# Altium schematic sheet [02] - BLOCK DIAGRAM.SchDoc
size A2; DocumentNumber: 3; SheetNumber: 3; SheetTotal: 9; PageSetup: Record=PageOptions|CenterHorizontal=True|CenterVertical=True|PrintScale=0.73|XCorrection=1.00|YCorrection=1.00|PrintKind=0|BorderSize=5000000|LeftOffset=0|BottomOffset=0|Orientation=2|PaperLength=1000|PaperWidth=1000|Scale=100|PaperSource=7|PrintQuality=-4|MediaType=1|DitherType=10|PaperKind=A3|PrintScaleMode=1
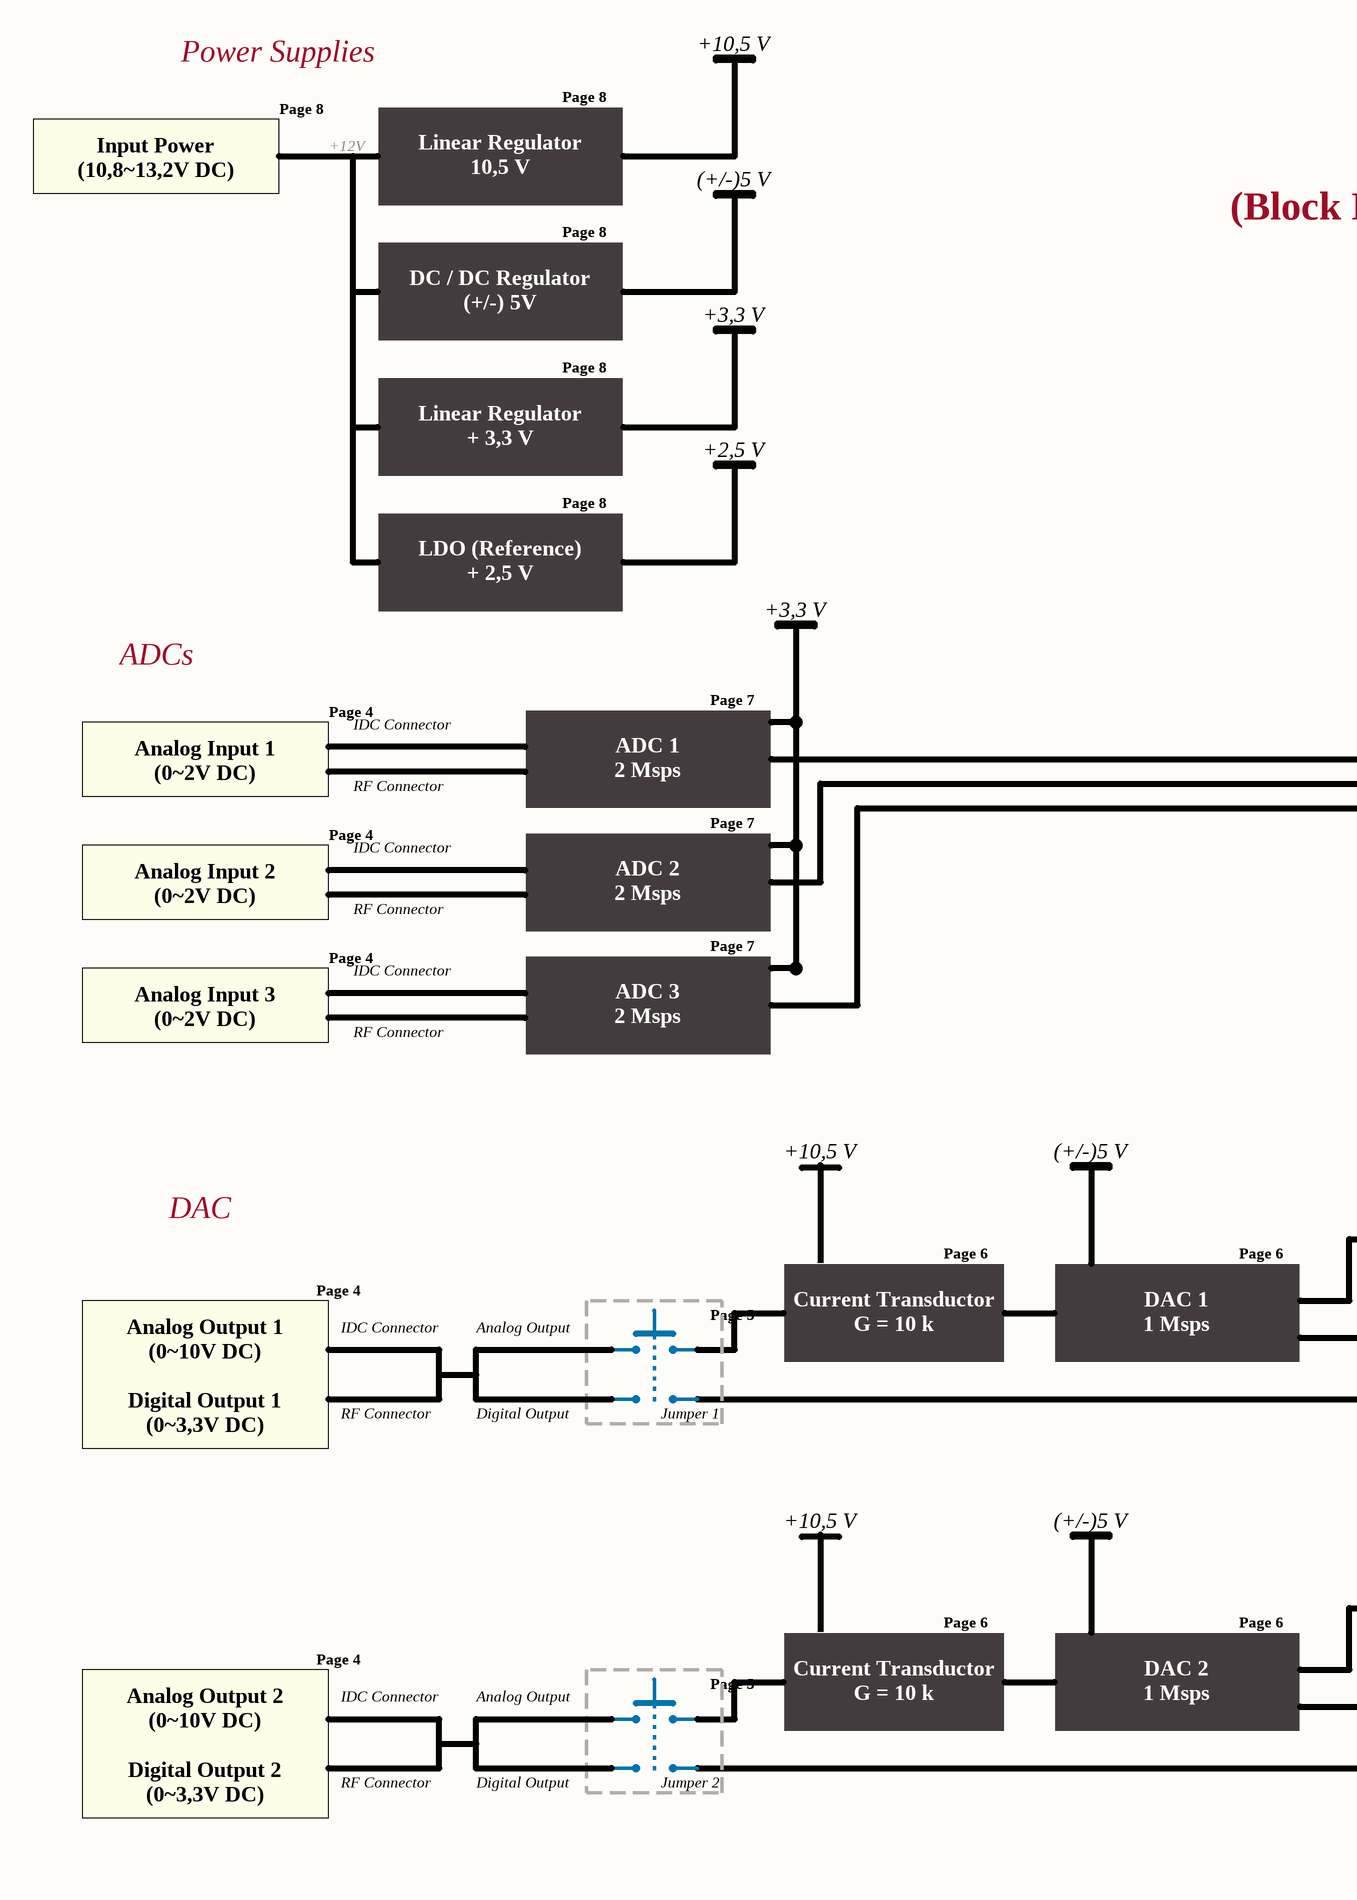
[diagram p0: [02] - BLOCK DIAGRAM.SchDoc, left]
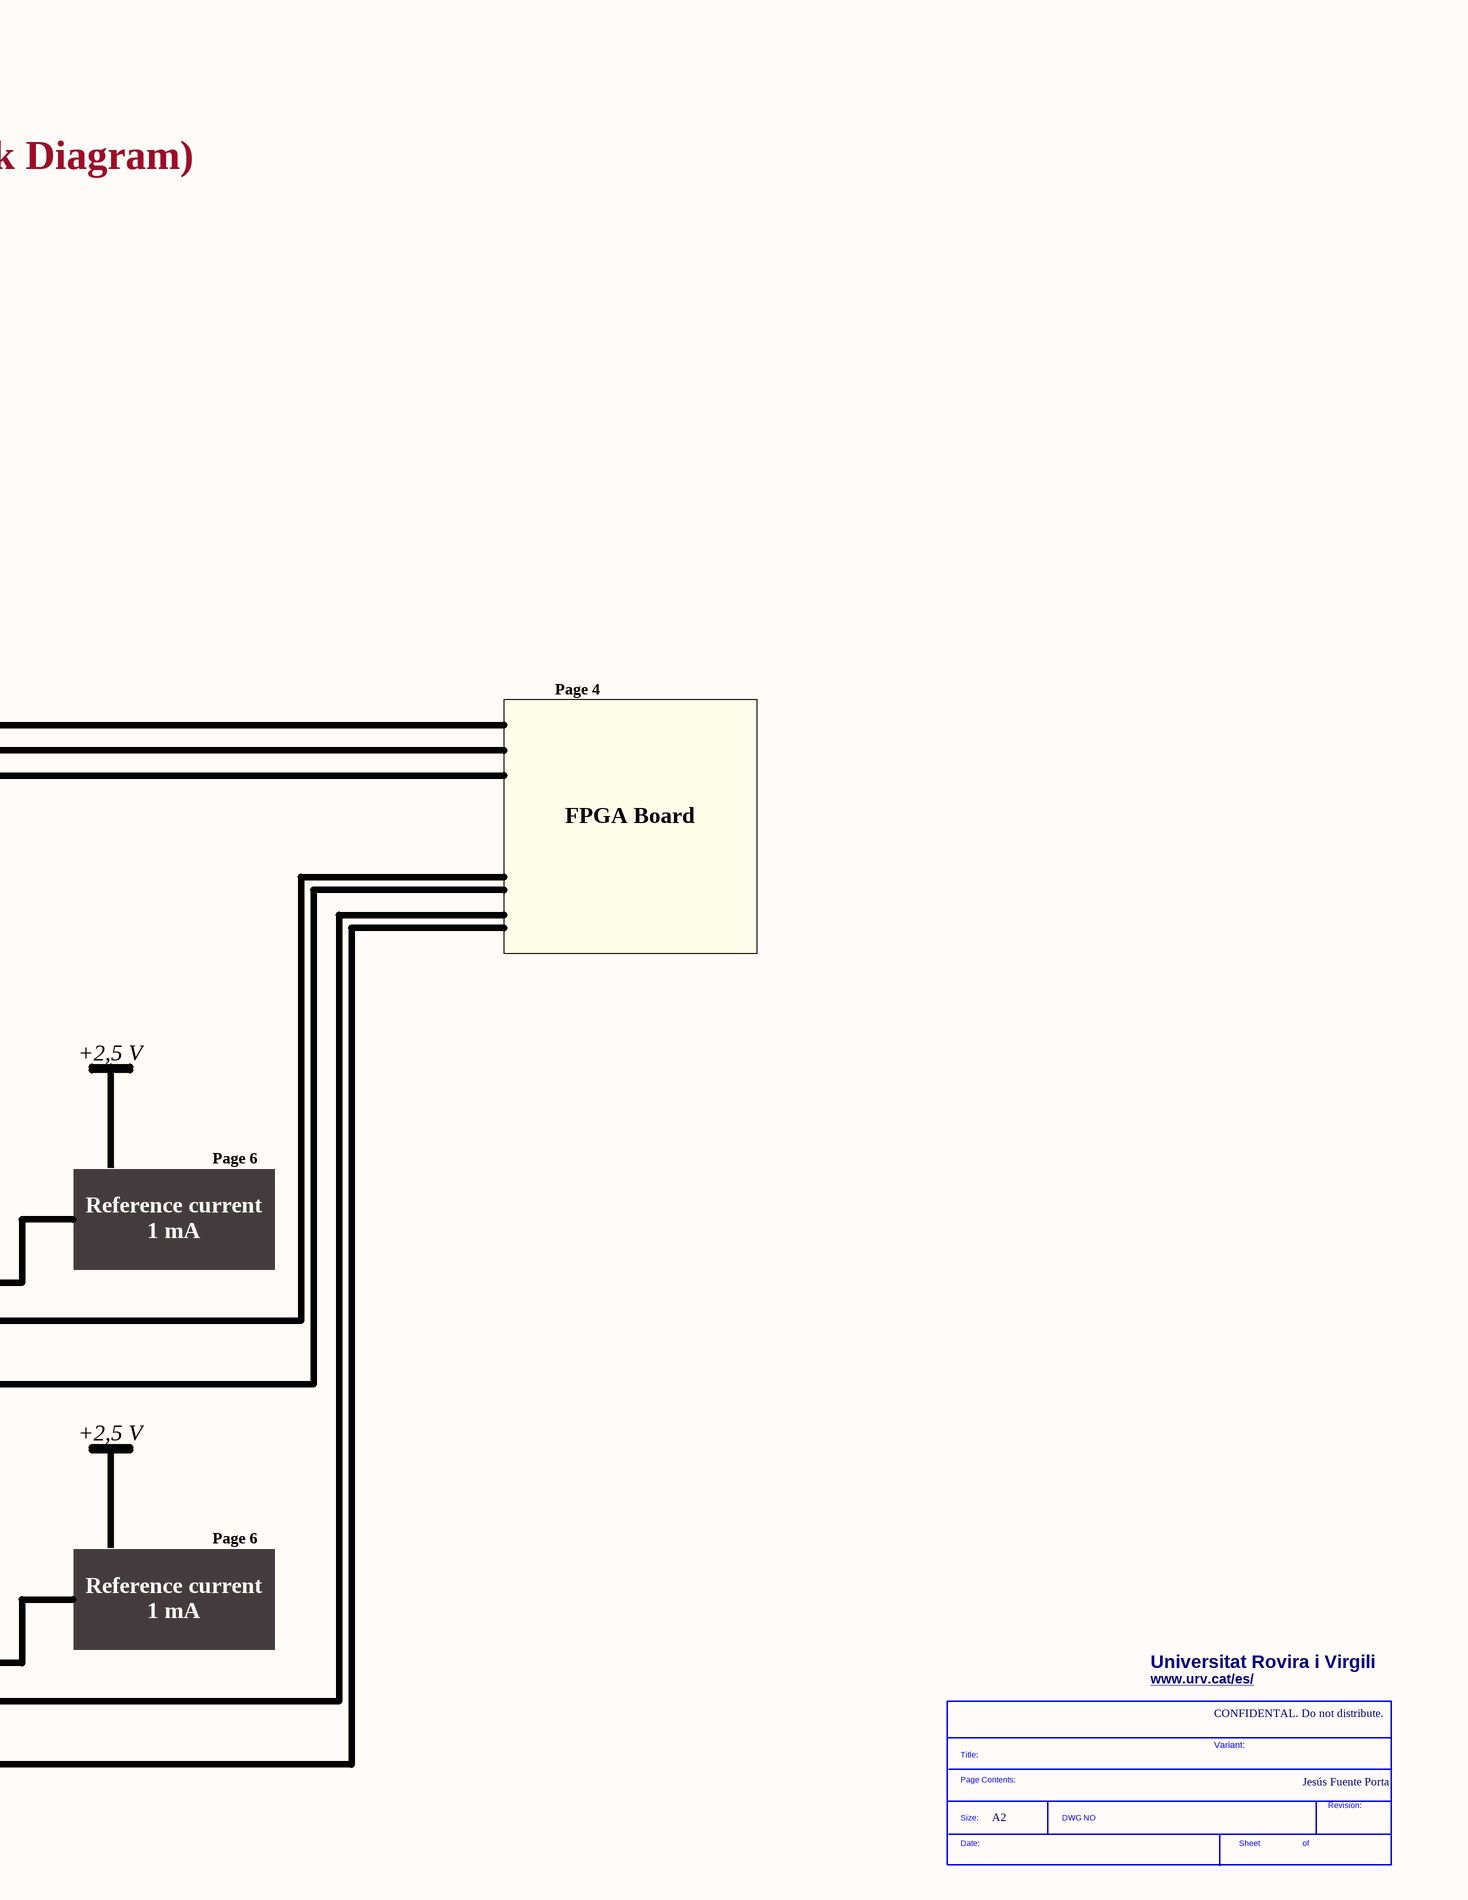
[diagram p1: [02] - BLOCK DIAGRAM.SchDoc, right]

## Parts
*  SDTitleBlock  (value not drawn)  (graphical)

## Notes on the sheet
- Power Supplies
- +10,5 V
- Input Power
- Page 8
- (10,8~13,2V DC)
- +12V
- Linear Regulator
- 10,5 V
- (+/-)5 V
- (Block Diagram)
- DC / DC Regulator
- (+/-) 5V
- +3,3 V
- + 3,3 V
- +2,5 V
- LDO (Reference)
- + 2,5 V
- ADCs
- Analog Input 1
- (0~2V DC)
- Page 4
- IDC Connector
- ADC 1
- Page 7
- RF Connector
- 2 Msps
- Analog Input 2
- ADC 2
- FPGA Board
- Analog Input 3
- ADC 3
- Page 6
- DAC
- Reference current
- Analog Output 1
- Current Transductor
- DAC 1
- 1 mA
- (0~10V DC)
- Analog Output
- Page 5
- G = 10 k
- 1 Msps
- Digital Output 1
- (0~3,3V DC)
- Digital Output
- Jumper 1
- Analog Output 2
- DAC 2
- Universitat Rovira i Virgili
- www.urv.cat/es/ <http://www.urv.cat/es/>
- CONFIDENTAL. Do not distribute.
- Digital Output 2
- Jumper 2
- Variant:
- Jesús Fuente Porta
- A2
- (in symbol SDTitleBlock) Title:; Page Contents:; Revision:; Size:; DWG NO; Date:; Sheet; of